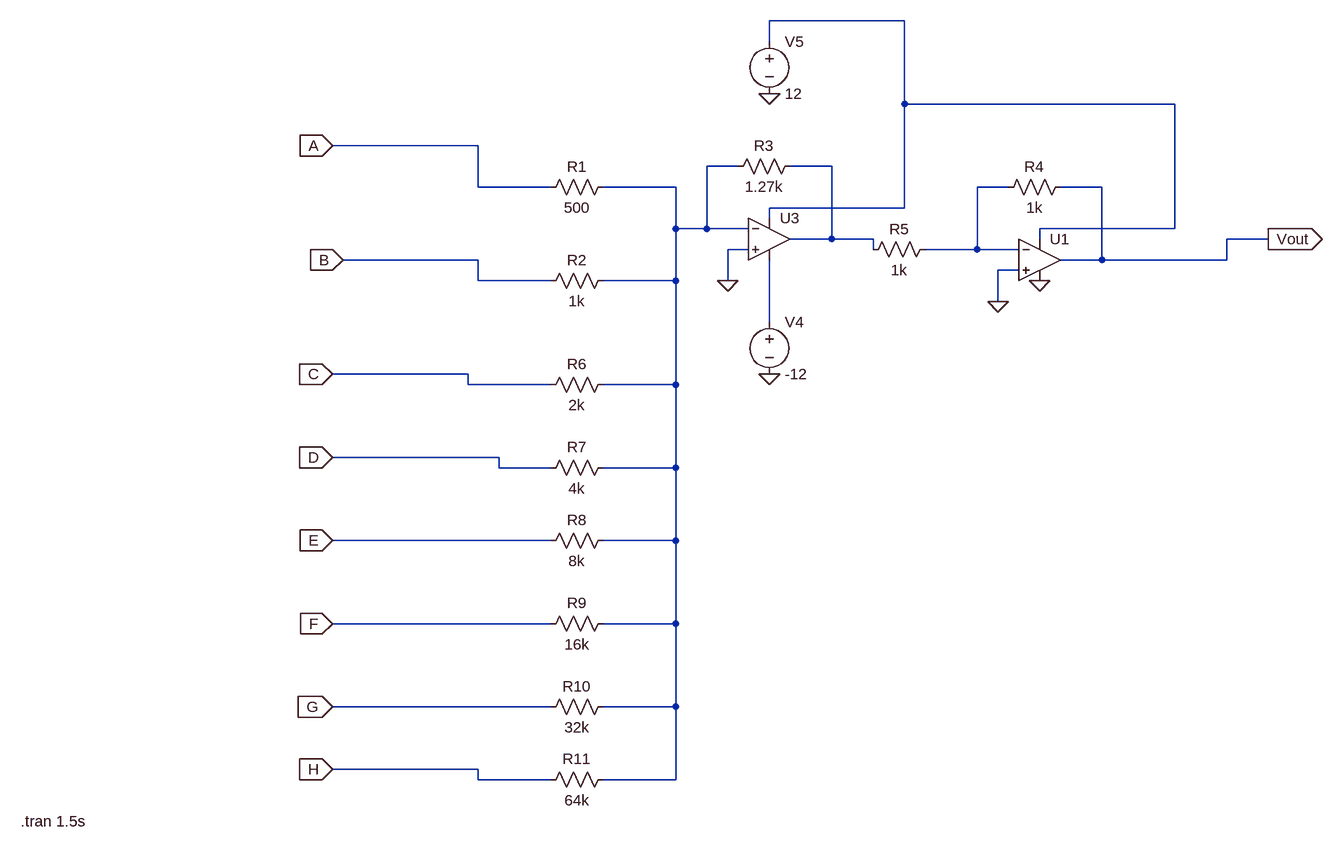
[diagram p0: schematic DAC10b.asc]
DAC10b.asc, the LTspice schematic file:
Version 4
SHEET 1 1184 1320
WIRE 512 -160 304 -160
WIRE 304 -128 304 -160
WIRE 512 -32 512 -160
WIRE 928 -32 512 -32
WIRE -144 32 -368 32
WIRE 256 64 208 64
WIRE 400 64 336 64
WIRE -144 96 -144 32
WIRE -32 96 -144 96
WIRE 160 96 48 96
WIRE 672 96 624 96
WIRE 816 96 752 96
WIRE 512 128 512 -32
WIRE 512 128 304 128
WIRE 304 144 304 128
WIRE 160 160 160 96
WIRE 208 160 208 64
WIRE 208 160 160 160
WIRE 272 160 208 160
WIRE 928 160 928 -32
WIRE 928 160 720 160
WIRE 400 176 400 64
WIRE 400 176 336 176
WIRE 464 176 400 176
WIRE 720 176 720 160
WIRE 1072 176 1008 176
WIRE 272 192 240 192
WIRE 464 192 464 176
WIRE 624 192 624 96
WIRE 624 192 544 192
WIRE 688 192 624 192
WIRE -144 208 -352 208
WIRE 816 208 816 96
WIRE 816 208 752 208
WIRE 1008 208 1008 176
WIRE 1008 208 816 208
WIRE 688 224 656 224
WIRE -144 240 -144 208
WIRE -32 240 -144 240
WIRE 160 240 160 160
WIRE 160 240 48 240
WIRE 240 240 240 192
WIRE 656 272 656 224
WIRE 304 304 304 208
WIRE -160 384 -368 384
WIRE -160 400 -160 384
WIRE -32 400 -160 400
WIRE 160 400 160 240
WIRE 160 400 48 400
WIRE -112 512 -368 512
WIRE -112 528 -112 512
WIRE -32 528 -112 528
WIRE 160 528 160 400
WIRE 160 528 48 528
WIRE -32 640 -368 640
WIRE 160 640 160 528
WIRE 160 640 48 640
WIRE -32 768 -368 768
WIRE 160 768 160 640
WIRE 160 768 48 768
WIRE -32 896 -368 896
WIRE 160 896 160 768
WIRE 160 896 48 896
WIRE -144 992 -368 992
WIRE -144 1008 -144 992
WIRE -32 1008 -144 1008
WIRE 160 1008 160 896
WIRE 160 1008 48 1008
FLAG 240 240 0
FLAG 1072 176 Vout
IOPIN 1072 176 Out
FLAG -368 32 A
IOPIN -368 32 In
FLAG -352 208 B
IOPIN -352 208 In
FLAG 304 -48 0
FLAG 656 272 0
FLAG 720 240 0
FLAG 304 384 0
FLAG -368 384 C
IOPIN -368 384 In
FLAG -368 512 D
IOPIN -368 512 In
FLAG -368 640 E
IOPIN -368 640 In
FLAG -368 768 F
IOPIN -368 768 In
FLAG -368 896 G
IOPIN -368 896 In
FLAG -368 992 H
IOPIN -368 992 In
SYMBOL res 64 80 R90
WINDOW 0 0 56 VBottom 2
WINDOW 3 32 56 VTop 2
SYMATTR InstName R1
SYMATTR Value 500
SYMBOL res 64 224 R90
WINDOW 0 0 56 VBottom 2
WINDOW 3 32 56 VTop 2
SYMATTR InstName R2
SYMATTR Value 1k
SYMBOL res 352 48 R90
WINDOW 0 0 56 VBottom 2
WINDOW 3 32 56 VTop 2
SYMATTR InstName R3
SYMATTR Value 1.27k
SYMBOL voltage 304 -144 R0
WINDOW 123 0 0 Left 0
WINDOW 39 0 0 Left 0
SYMATTR InstName V5
SYMATTR Value 12
SYMBOL Opamps\\UniversalOpamp2 304 176 R0
SYMATTR InstName U3
SYMBOL res 768 80 R90
WINDOW 0 0 56 VBottom 2
WINDOW 3 32 56 VTop 2
SYMATTR InstName R4
SYMATTR Value 1k
SYMBOL Opamps\\UniversalOpamp2 720 208 R0
SYMATTR InstName U1
SYMBOL res 560 176 R90
WINDOW 0 0 56 VBottom 2
WINDOW 3 32 56 VTop 2
SYMATTR InstName R5
SYMATTR Value 1k
SYMBOL voltage 304 288 R0
WINDOW 123 0 0 Left 0
WINDOW 39 0 0 Left 0
SYMATTR InstName V4
SYMATTR Value -12
SYMBOL res 64 384 R90
WINDOW 0 0 56 VBottom 2
WINDOW 3 32 56 VTop 2
SYMATTR InstName R6
SYMATTR Value 2k
SYMBOL res 64 512 R90
WINDOW 0 0 56 VBottom 2
WINDOW 3 32 56 VTop 2
SYMATTR InstName R7
SYMATTR Value 4k
SYMBOL res 64 624 R90
WINDOW 0 0 56 VBottom 2
WINDOW 3 32 56 VTop 2
SYMATTR InstName R8
SYMATTR Value 8k
SYMBOL res 64 752 R90
WINDOW 0 0 56 VBottom 2
WINDOW 3 32 56 VTop 2
SYMATTR InstName R9
SYMATTR Value 16k
SYMBOL res 64 880 R90
WINDOW 0 0 56 VBottom 2
WINDOW 3 32 56 VTop 2
SYMATTR InstName R10
SYMATTR Value 32k
SYMBOL res 64 992 R90
WINDOW 0 0 56 VBottom 2
WINDOW 3 32 56 VTop 2
SYMATTR InstName R11
SYMATTR Value 64k
TEXT -848 1072 Left 2 !.tran 1.5s

The netlist it stands for:
* DAC10b.asc
R1 N002 A 500
R2 N002 B 1k
R3 N003 N002 1.27k
V5 N001 0 12
XU3 0 N002 N001 N005 N003 level.2 Avol=1Meg GBW=10Meg Slew=10Meg ilimit=25m rail=0 Vos=0 phimargin=45 en=0 enk=0 in=0 ink=0 Rin=500Meg  ; pins IN+ IN- V+ V- OUT
R4 Vout N004 1k
XU1 0 N004 N001 0 Vout level.2 Avol=1Meg GBW=10Meg Slew=10Meg ilimit=25m rail=0 Vos=0 phimargin=45 en=0 enk=0 in=0 ink=0 Rin=500Meg  ; pins IN+ IN- V+ V- OUT
R5 N004 N003 1k
V4 N005 0 -12
R6 N002 C 2k
R7 N002 D 4k
R8 N002 E 8k
R9 N002 F 16k
R10 N002 G 32k
R11 N002 H 64k
.tran 1.5s
.lib UniversalOpamps2.sub
.backanno
.end